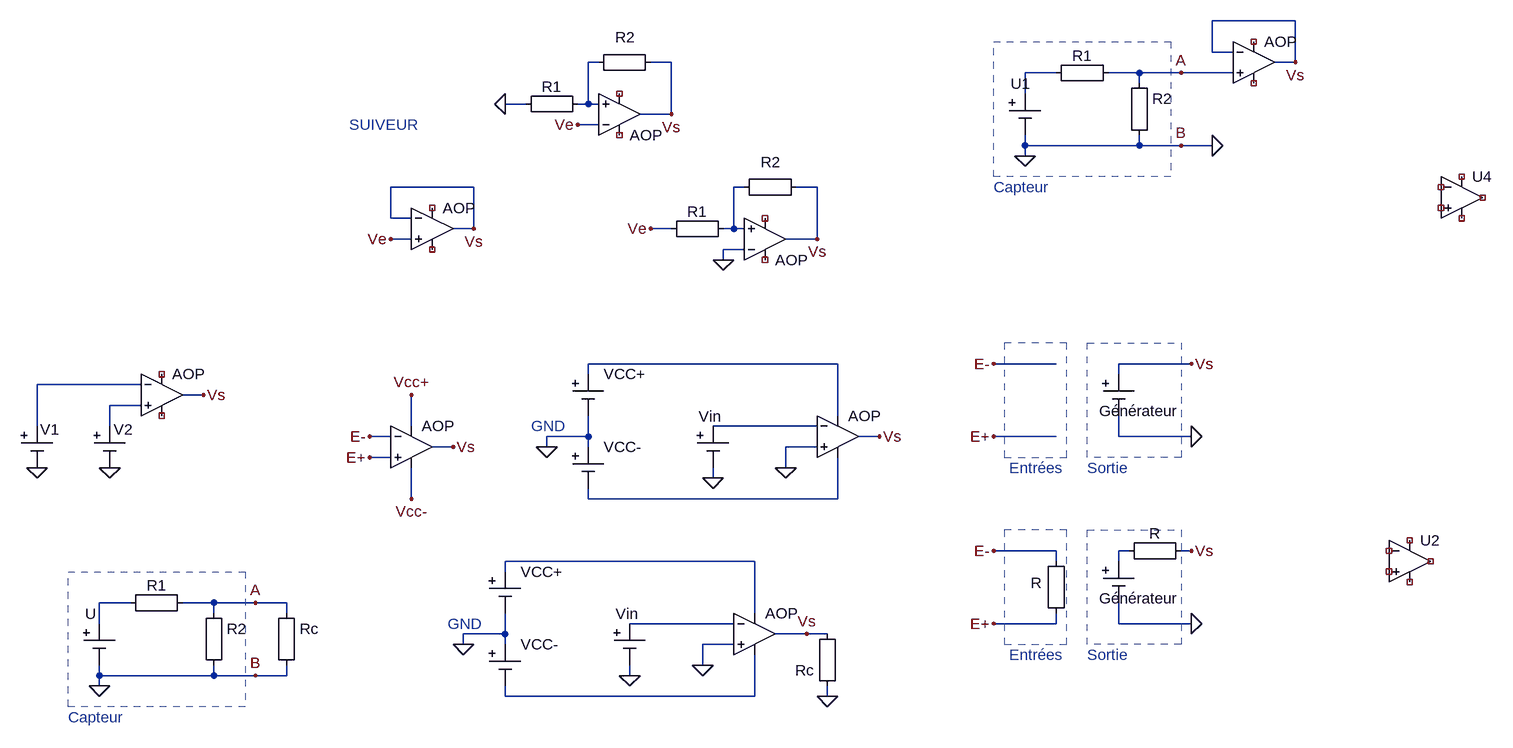
[diagram p0: schematic AOP_1.asc]
AOP_1.asc, the LTspice schematic file:
Version 4
SHEET 1 880 680
WIRE 352 -672 224 -672
WIRE 224 -624 224 -672
WIRE 256 -624 224 -624
WIRE -720 -608 -736 -608
WIRE -608 -608 -640 -608
WIRE 352 -608 352 -672
WIRE 352 -608 320 -608
WIRE -16 -592 -64 -592
WIRE 112 -592 64 -592
WIRE 176 -592 112 -592
WIRE 256 -592 176 -592
WIRE 112 -576 112 -592
WIRE -64 -560 -64 -592
WIRE -832 -544 -864 -544
WIRE -736 -544 -736 -608
WIRE -736 -544 -752 -544
WIRE -720 -544 -736 -544
WIRE -608 -528 -608 -608
WIRE -608 -528 -656 -528
WIRE -720 -512 -752 -512
WIRE -64 -480 -64 -496
WIRE 112 -480 112 -496
WIRE 112 -480 -64 -480
WIRE 176 -480 112 -480
WIRE 224 -480 176 -480
WIRE -64 -464 -64 -480
WIRE -912 -416 -1040 -416
WIRE -496 -416 -512 -416
WIRE -384 -416 -416 -416
WIRE -1040 -368 -1040 -416
WIRE -1008 -368 -1040 -368
WIRE -912 -352 -912 -416
WIRE -912 -352 -944 -352
WIRE -608 -352 -640 -352
WIRE -512 -352 -512 -416
WIRE -512 -352 -528 -352
WIRE -496 -352 -512 -352
WIRE -1008 -336 -1040 -336
WIRE -384 -336 -384 -416
WIRE -384 -336 -432 -336
WIRE -496 -320 -528 -320
WIRE -528 -304 -528 -320
WIRE -352 -144 -736 -144
WIRE -16 -144 -112 -144
WIRE 192 -144 80 -144
WIRE -736 -128 -736 -144
WIRE 80 -128 80 -144
WIRE -1424 -112 -1584 -112
WIRE -1328 -96 -1360 -96
WIRE -1424 -80 -1472 -80
WIRE -352 -64 -352 -144
WIRE -1584 -48 -1584 -112
WIRE -1472 -48 -1472 -80
WIRE -1008 -48 -1008 -96
WIRE -384 -48 -544 -48
WIRE -1040 -32 -1072 -32
WIRE -736 -32 -736 -64
WIRE -736 -32 -800 -32
WIRE -288 -32 -320 -32
WIRE -16 -32 -112 -32
WIRE 80 -32 80 -64
WIRE 192 -32 80 -32
WIRE -944 -16 -976 -16
WIRE -800 -16 -800 -32
WIRE -736 -16 -736 -32
WIRE -384 -16 -432 -16
WIRE -1040 0 -1072 0
WIRE -432 16 -432 -16
WIRE -544 32 -544 16
WIRE -1008 64 -1008 16
WIRE -736 64 -736 48
WIRE -352 64 -352 0
WIRE -352 64 -736 64
WIRE -16 144 -112 144
WIRE 96 144 80 144
WIRE 192 144 176 144
WIRE -480 160 -864 160
WIRE -16 160 -16 144
WIRE 80 160 80 144
WIRE -864 176 -864 160
WIRE -1440 224 -1488 224
WIRE -1312 224 -1360 224
WIRE -1248 224 -1312 224
WIRE -1200 224 -1248 224
WIRE -1312 240 -1312 224
WIRE -1200 240 -1200 224
WIRE -480 240 -480 160
WIRE -1488 256 -1488 224
WIRE -512 256 -672 256
WIRE -16 256 -16 240
WIRE -16 256 -112 256
WIRE 80 256 80 224
WIRE 192 256 80 256
WIRE -864 272 -864 240
WIRE -864 272 -928 272
WIRE -400 272 -448 272
WIRE -368 272 -400 272
WIRE -928 288 -928 272
WIRE -864 288 -864 272
WIRE -512 288 -560 288
WIRE -560 320 -560 288
WIRE -1488 336 -1488 320
WIRE -1312 336 -1312 320
WIRE -1312 336 -1488 336
WIRE -1248 336 -1312 336
WIRE -1200 336 -1200 320
WIRE -1200 336 -1248 336
WIRE -672 336 -672 320
WIRE -1488 352 -1488 336
WIRE -864 368 -864 352
WIRE -480 368 -480 304
WIRE -480 368 -864 368
WIRE -368 368 -368 352
FLAG -1040 -336 Ve
FLAG -912 -352 Vs
FLAG -1072 0 E+
FLAG -944 -16 Vs
FLAG -1008 -96 Vcc+
FLAG -1008 64 Vcc-
FLAG -1072 -32 E-
FLAG -288 -32 Vs
FLAG -800 -16 0
FLAG -432 16 0
FLAG -544 32 0
FLAG -112 -144 E-
FLAG -112 -32 E+
FLAG 192 -144 Vs
FLAG 192 -32 0
FLAG -112 144 E-
FLAG -112 256 E+
FLAG 192 144 Vs
FLAG 192 256 0
FLAG -928 288 0
FLAG -560 320 0
FLAG -672 336 0
FLAG -368 368 0
FLAG -400 272 Vs
FLAG -1488 352 0
FLAG -1248 224 A
FLAG -1248 336 B
FLAG -64 -464 0
FLAG 176 -592 A
FLAG 176 -480 B
FLAG 352 -608 Vs
FLAG 224 -480 0
FLAG -640 -352 Ve
FLAG -528 -304 0
FLAG -384 -336 Vs
FLAG -1328 -96 Vs
FLAG -1472 16 0
FLAG -1584 16 0
FLAG -608 -528 Vs
FLAG -864 -544 0
FLAG -752 -512 Ve
SYMBOL Opamps\\UniversalOpamp2 -976 -352 R0
SYMATTR InstName AOP
SYMBOL Opamps\\UniversalOpamp2 528 160 R0
SYMATTR InstName U2
SYMBOL Opamps\\UniversalOpamp2 -464 -336 M180
SYMATTR InstName AOP
SYMBOL Misc\\EuropeanResistor -512 -368 R90
WINDOW 0 5 56 VBottom 2
WINDOW 3 27 56 VTop 2
SYMATTR InstName R1
SYMATTR Value ""
SYMBOL Misc\\EuropeanResistor -400 -432 R90
WINDOW 0 -7 55 VBottom 2
WINDOW 3 27 56 VTop 2
SYMATTR InstName R2
SYMATTR Value ""
SYMBOL Opamps\\UniversalOpamp2 -1008 -16 R0
SYMATTR InstName AOP
SYMBOL Opamps\\UniversalOpamp2 -352 -32 R0
SYMATTR InstName AOP
SYMBOL Misc\\cell -736 -16 R0
WINDOW 123 0 0 Left 2
WINDOW 39 0 0 Left 2
SYMATTR InstName VCC-
SYMATTR Value ""
SYMBOL Misc\\cell -736 -128 R0
WINDOW 123 0 0 Left 2
WINDOW 39 0 0 Left 2
SYMATTR InstName VCC+
SYMATTR Value ""
SYMBOL Misc\\cell -544 -48 R0
WINDOW 0 -22 -15 Left 2
SYMATTR InstName Vin
SYMATTR Value ""
SYMBOL Misc\\cell 80 -128 R0
WINDOW 0 -30 57 Left 2
SYMATTR InstName Générateur
SYMATTR Value ""
SYMBOL Misc\\cell 80 160 R0
WINDOW 0 -30 57 Left 2
SYMATTR InstName Générateur
SYMATTR Value ""
SYMBOL Misc\\EuropeanResistor 0 256 R180
WINDOW 0 38 63 Left 2
WINDOW 3 31 19 Left 2
SYMATTR InstName R
SYMATTR Value ""
SYMBOL Misc\\EuropeanResistor 80 160 R270
WINDOW 0 27 56 VTop 2
WINDOW 3 5 56 VBottom 2
SYMATTR InstName R
SYMATTR Value ""
SYMBOL Opamps\\UniversalOpamp2 -480 272 R0
SYMATTR InstName AOP
SYMBOL Misc\\cell -864 288 R0
WINDOW 123 0 0 Left 2
WINDOW 39 0 0 Left 2
SYMATTR InstName VCC-
SYMATTR Value ""
SYMBOL Misc\\cell -864 176 R0
WINDOW 123 0 0 Left 2
WINDOW 39 0 0 Left 2
SYMATTR InstName VCC+
SYMATTR Value ""
SYMBOL Misc\\cell -672 256 R0
WINDOW 0 -22 -15 Left 2
SYMATTR InstName Vin
SYMATTR Value ""
SYMBOL Misc\\EuropeanResistor -352 368 R180
WINDOW 3 31 19 Left 2
SYMATTR InstName Rc
SYMATTR Value ""
SYMBOL Misc\\cell -1488 256 R0
WINDOW 0 -22 -15 Left 2
SYMATTR InstName U
SYMATTR Value ""
SYMBOL Misc\\EuropeanResistor -1456 240 R270
WINDOW 0 27 56 VTop 2
WINDOW 3 5 56 VBottom 2
SYMATTR InstName R1
SYMATTR Value ""
SYMBOL Misc\\EuropeanResistor -1328 224 R0
SYMATTR InstName R2
SYMATTR Value ""
SYMBOL Misc\\EuropeanResistor -1216 224 R0
SYMATTR InstName Rc
SYMATTR Value ""
SYMBOL Misc\\cell -64 -560 R0
WINDOW 0 -22 -15 Left 2
SYMATTR InstName U1
SYMATTR Value ""
SYMBOL Misc\\EuropeanResistor -32 -576 R270
WINDOW 0 27 56 VTop 2
WINDOW 3 5 56 VBottom 2
SYMATTR InstName R1
SYMATTR Value ""
SYMBOL Misc\\EuropeanResistor 96 -592 R0
WINDOW 3 31 68 Left 2
SYMATTR InstName R2
SYMATTR Value ""
SYMBOL Opamps\\UniversalOpamp2 288 -608 R0
SYMATTR InstName AOP
SYMBOL Opamps\\UniversalOpamp2 608 -400 R0
SYMATTR InstName U4
SYMBOL Opamps\\UniversalOpamp2 -1392 -96 R0
SYMATTR InstName AOP
SYMBOL Misc\\cell -1584 -48 R0
WINDOW 0 5 5 Left 2
SYMATTR InstName V1
SYMATTR Value ""
SYMBOL Misc\\cell -1472 -48 R0
WINDOW 0 6 5 Left 2
SYMATTR InstName V2
SYMATTR Value ""
SYMBOL Opamps\\UniversalOpamp2 -688 -528 M180
SYMATTR InstName AOP
SYMBOL Misc\\EuropeanResistor -736 -560 R90
WINDOW 0 5 56 VBottom 2
WINDOW 3 27 56 VTop 2
SYMATTR InstName R1
SYMATTR Value ""
SYMBOL Misc\\EuropeanResistor -624 -624 R90
WINDOW 0 -7 55 VBottom 2
WINDOW 3 27 56 VTop 2
SYMATTR InstName R2
SYMATTR Value ""
TEXT -1104 -512 Left 2 ;SUIVEUR
TEXT -824 -48 Left 2 ;GND
TEXT -88 16 Left 2 ;Entrées
TEXT 32 16 Left 2 ;Sortie
TEXT -88 304 Left 2 ;Entrées
TEXT 32 304 Left 2 ;Sortie
TEXT -952 256 Left 2 ;GND
TEXT -1536 400 Left 2 ;Capteur
TEXT -112 -416 Left 2 ;Capteur
RECTANGLE Normal -96 0 0 -176 2
RECTANGLE Normal 176 0 32 -176 2
RECTANGLE Normal -96 288 0 112 2
RECTANGLE Normal 176 288 32 112 2
RECTANGLE Normal -1264 384 -1536 176 2
RECTANGLE Normal 160 -432 -112 -640 2

The netlist it stands for:
* AOP_1.asc
XAOP Ve Vs NC_01 NC_02 Vs level.2 Avol=1Meg GBW=10Meg Slew=10Meg ilimit=25m rail=0 Vos=0 phimargin=45 en=0 enk=0 in=0 ink=0 Rin=500Meg  ; pins IN+ IN- V+ V- OUT
XU2 NC_03 NC_04 NC_05 NC_06 NC_07 level.2 Avol=1Meg GBW=10Meg Slew=10Meg ilimit=25m rail=0 Vos=0 phimargin=45 en=0 enk=0 in=0 ink=0 Rin=500Meg  ; pins IN+ IN- V+ V- OUT
XAOP N003 0 NC_08 NC_09 Vs level.2 Avol=1Meg GBW=10Meg Slew=10Meg ilimit=25m rail=0 Vos=0 phimargin=45 en=0 enk=0 in=0 ink=0 Rin=500Meg  ; pins IN+ IN- V+ V- OUT
R1 N003 Ve
R2 Vs N003
XAOP E+ E- Vcc+ Vcc- Vs level.2 Avol=1Meg GBW=10Meg Slew=10Meg ilimit=25m rail=0 Vos=0 phimargin=45 en=0 enk=0 in=0 ink=0 Rin=500Meg  ; pins IN+ IN- V+ V- OUT
XAOP 0 N007 N004 N008 Vs level.2 Avol=1Meg GBW=10Meg Slew=10Meg ilimit=25m rail=0 Vos=0 phimargin=45 en=0 enk=0 in=0 ink=0 Rin=500Meg  ; pins IN+ IN- V+ V- OUT
VCC- 0 N008
VCC+ N004 0
Vin N007 0
V§Générateur Vs 0
V§Générateur N009 0
R E+ E-
R N009 Vs
XAOP 0 N012 N010 N013 Vs level.2 Avol=1Meg GBW=10Meg Slew=10Meg ilimit=25m rail=0 Vos=0 phimargin=45 en=0 enk=0 in=0 ink=0 Rin=500Meg  ; pins IN+ IN- V+ V- OUT
VCC- 0 N013
VCC+ N010 0
Vin N012 0
Rc 0 Vs
V§U N011 0
R1 N011 A
R2 A 0
Rc A 0
V§U1 N002 0
R1 N002 A
R2 A 0
XAOP A Vs NC_10 NC_11 Vs level.2 Avol=1Meg GBW=10Meg Slew=10Meg ilimit=25m rail=0 Vos=0 phimargin=45 en=0 enk=0 in=0 ink=0 Rin=500Meg  ; pins IN+ IN- V+ V- OUT
XU4 NC_12 NC_13 NC_14 NC_15 NC_16 level.2 Avol=1Meg GBW=10Meg Slew=10Meg ilimit=25m rail=0 Vos=0 phimargin=45 en=0 enk=0 in=0 ink=0 Rin=500Meg  ; pins IN+ IN- V+ V- OUT
XAOP N006 N005 NC_17 NC_18 Vs level.2 Avol=1Meg GBW=10Meg Slew=10Meg ilimit=25m rail=0 Vos=0 phimargin=45 en=0 enk=0 in=0 ink=0 Rin=500Meg  ; pins IN+ IN- V+ V- OUT
V1 N005 0
V2 N006 0
XAOP N001 Ve NC_19 NC_20 Vs level.2 Avol=1Meg GBW=10Meg Slew=10Meg ilimit=25m rail=0 Vos=0 phimargin=45 en=0 enk=0 in=0 ink=0 Rin=500Meg  ; pins IN+ IN- V+ V- OUT
R1 N001 0
R2 Vs N001
* SUIVEUR
* GND
* Entrées
* Sortie
* Entrées
* Sortie
* GND
* Capteur
* Capteur
.lib UniversalOpamps2.sub
.backanno
.end